# Altium schematic sheet Schematic1_PCBr7.SchDoc
size 599 x 900 mm; SheetNumber: 1; SheetTotal: 1
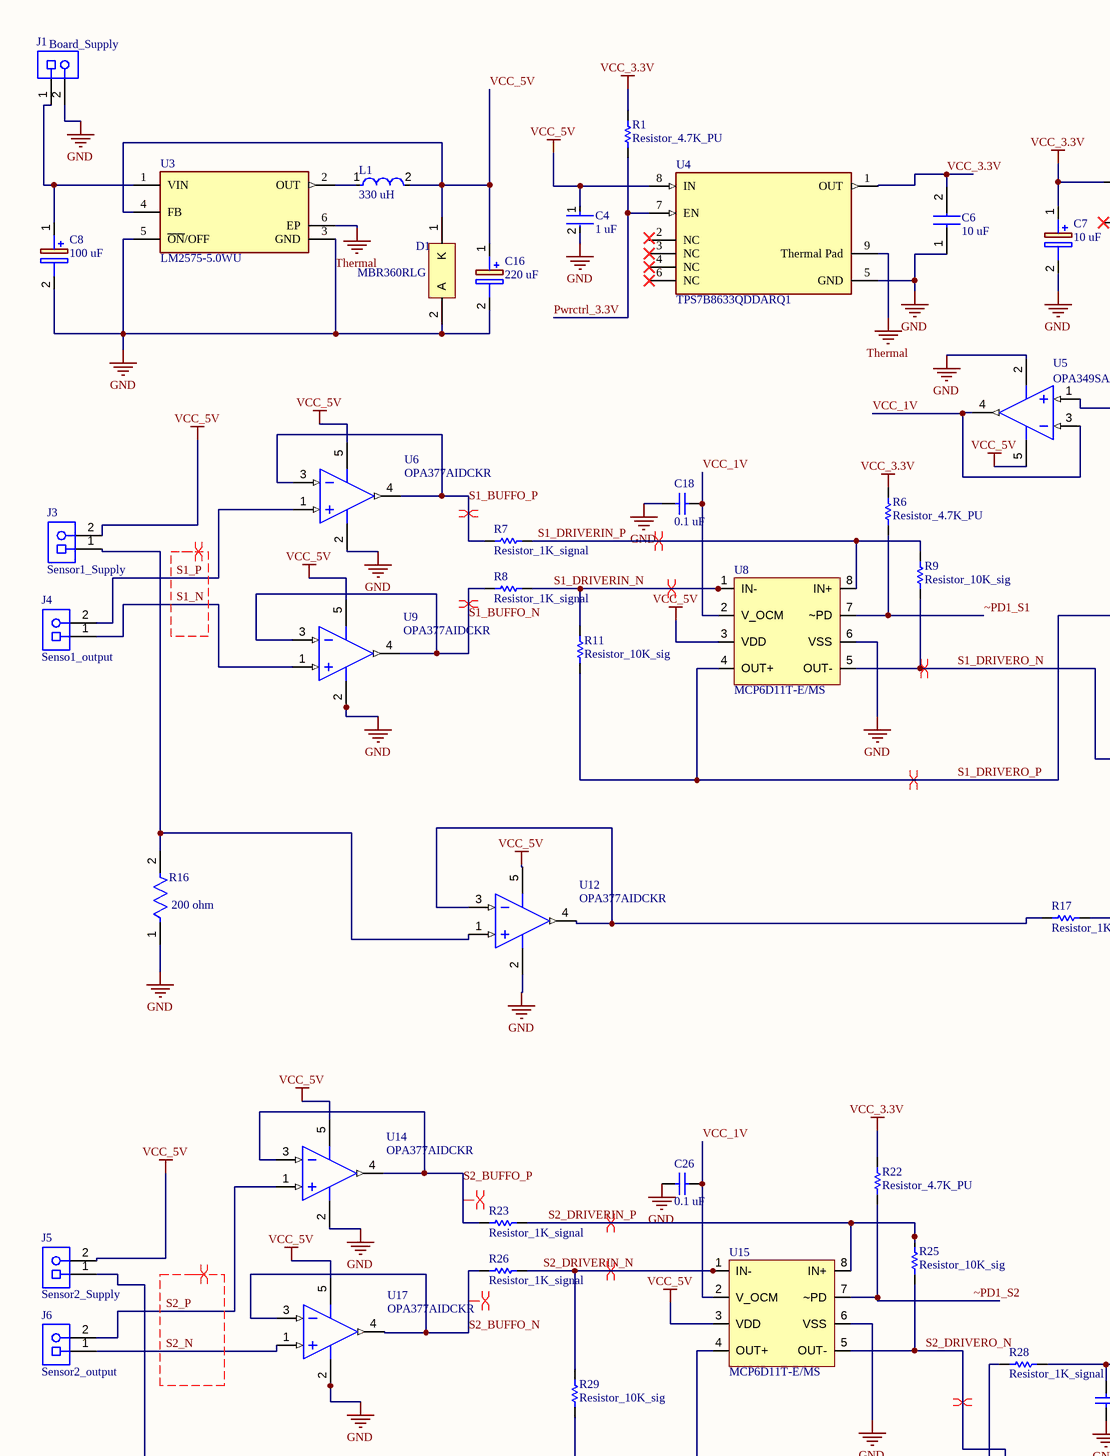
[diagram p0: Schematic1_PCBr7.SchDoc, top left]
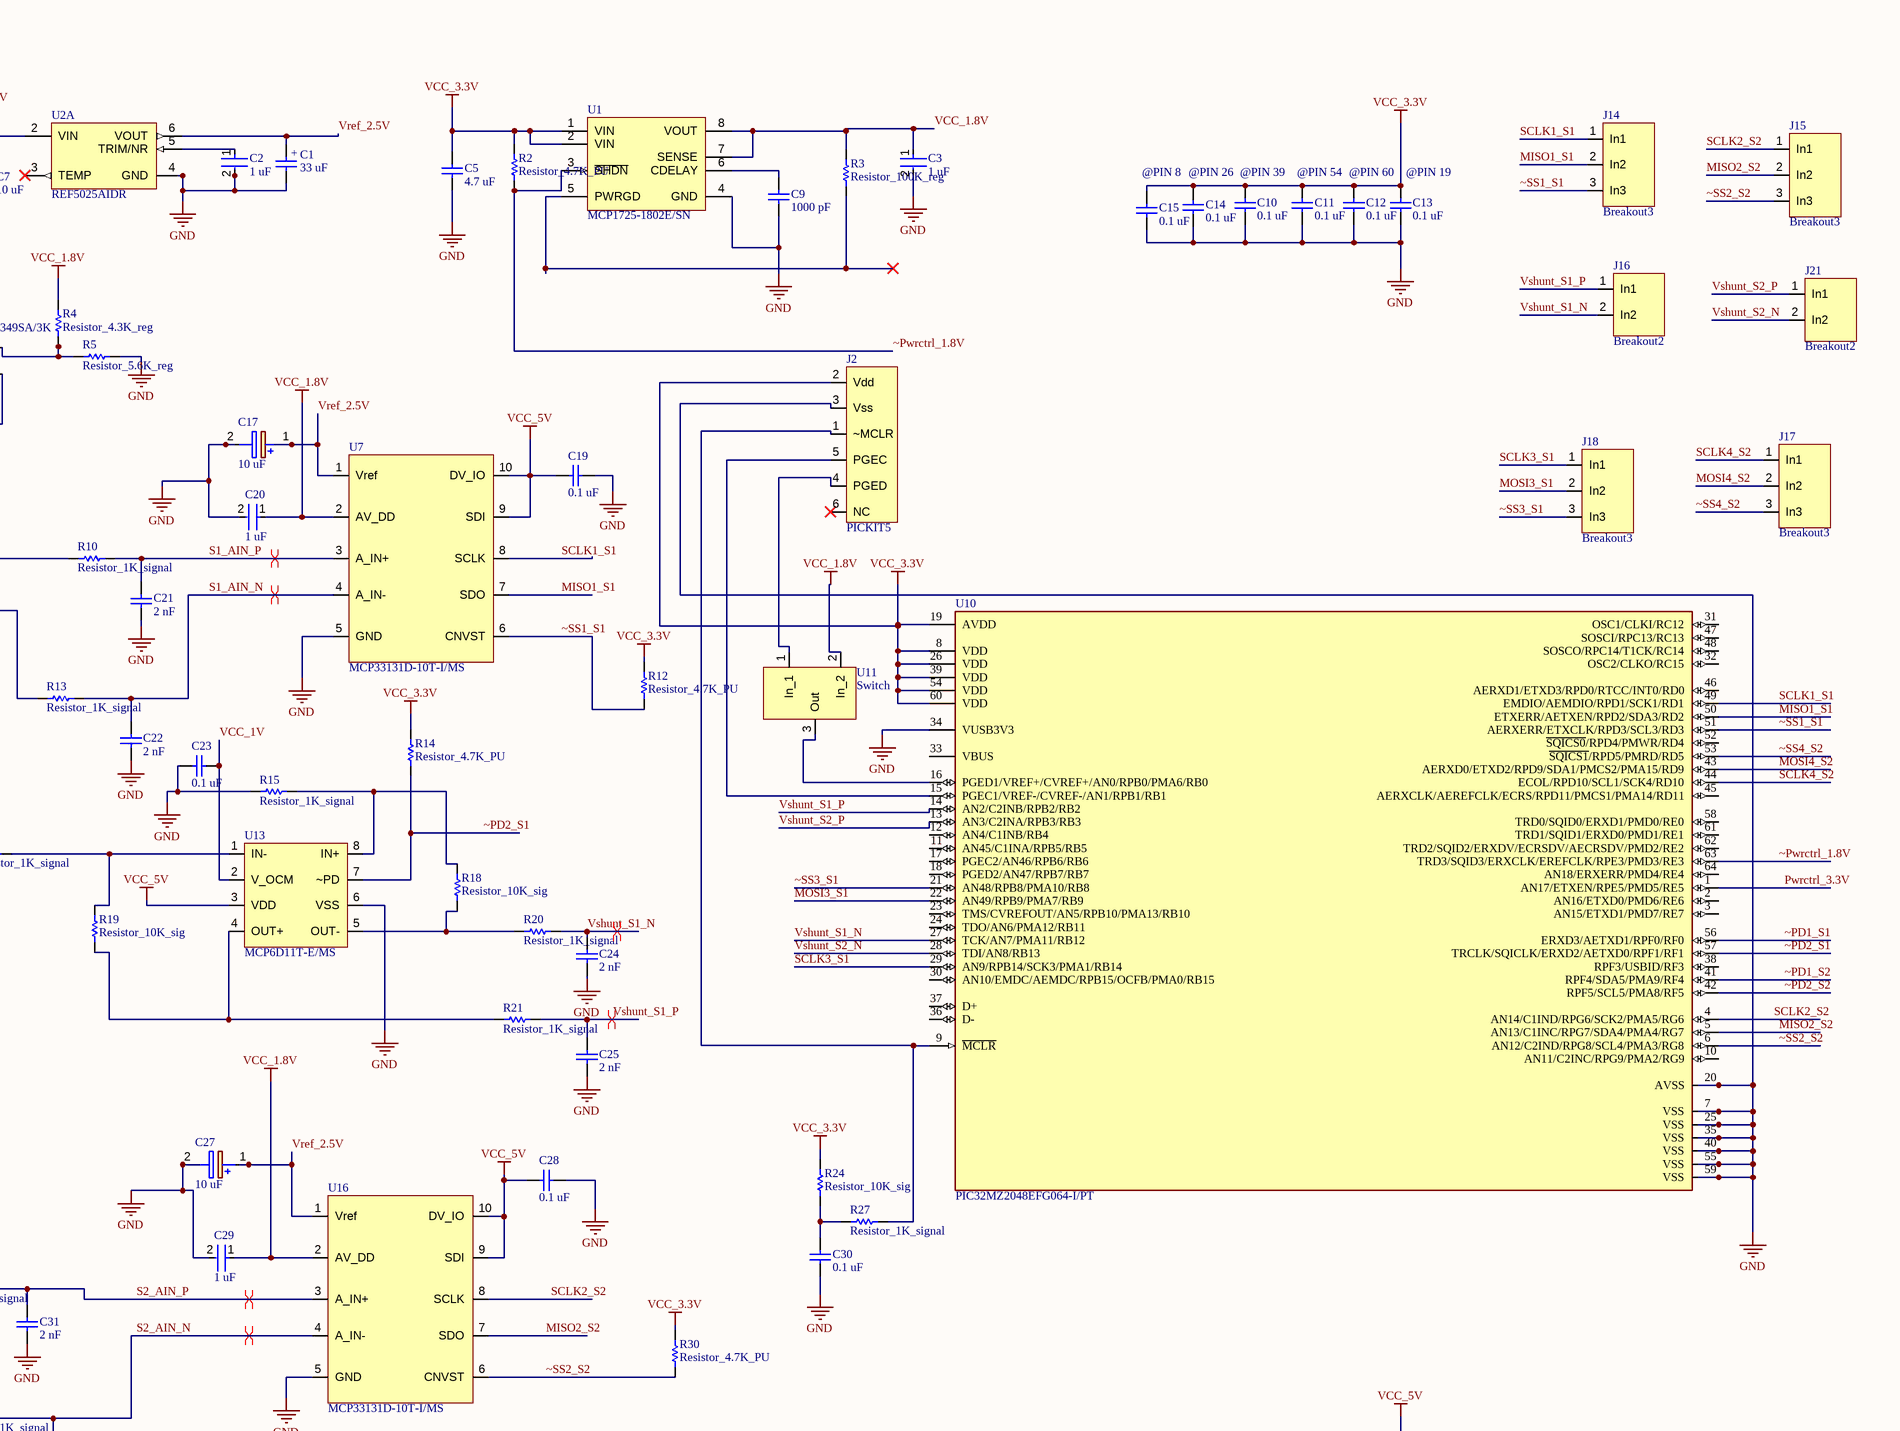
[diagram p1: Schematic1_PCBr7.SchDoc, top right]
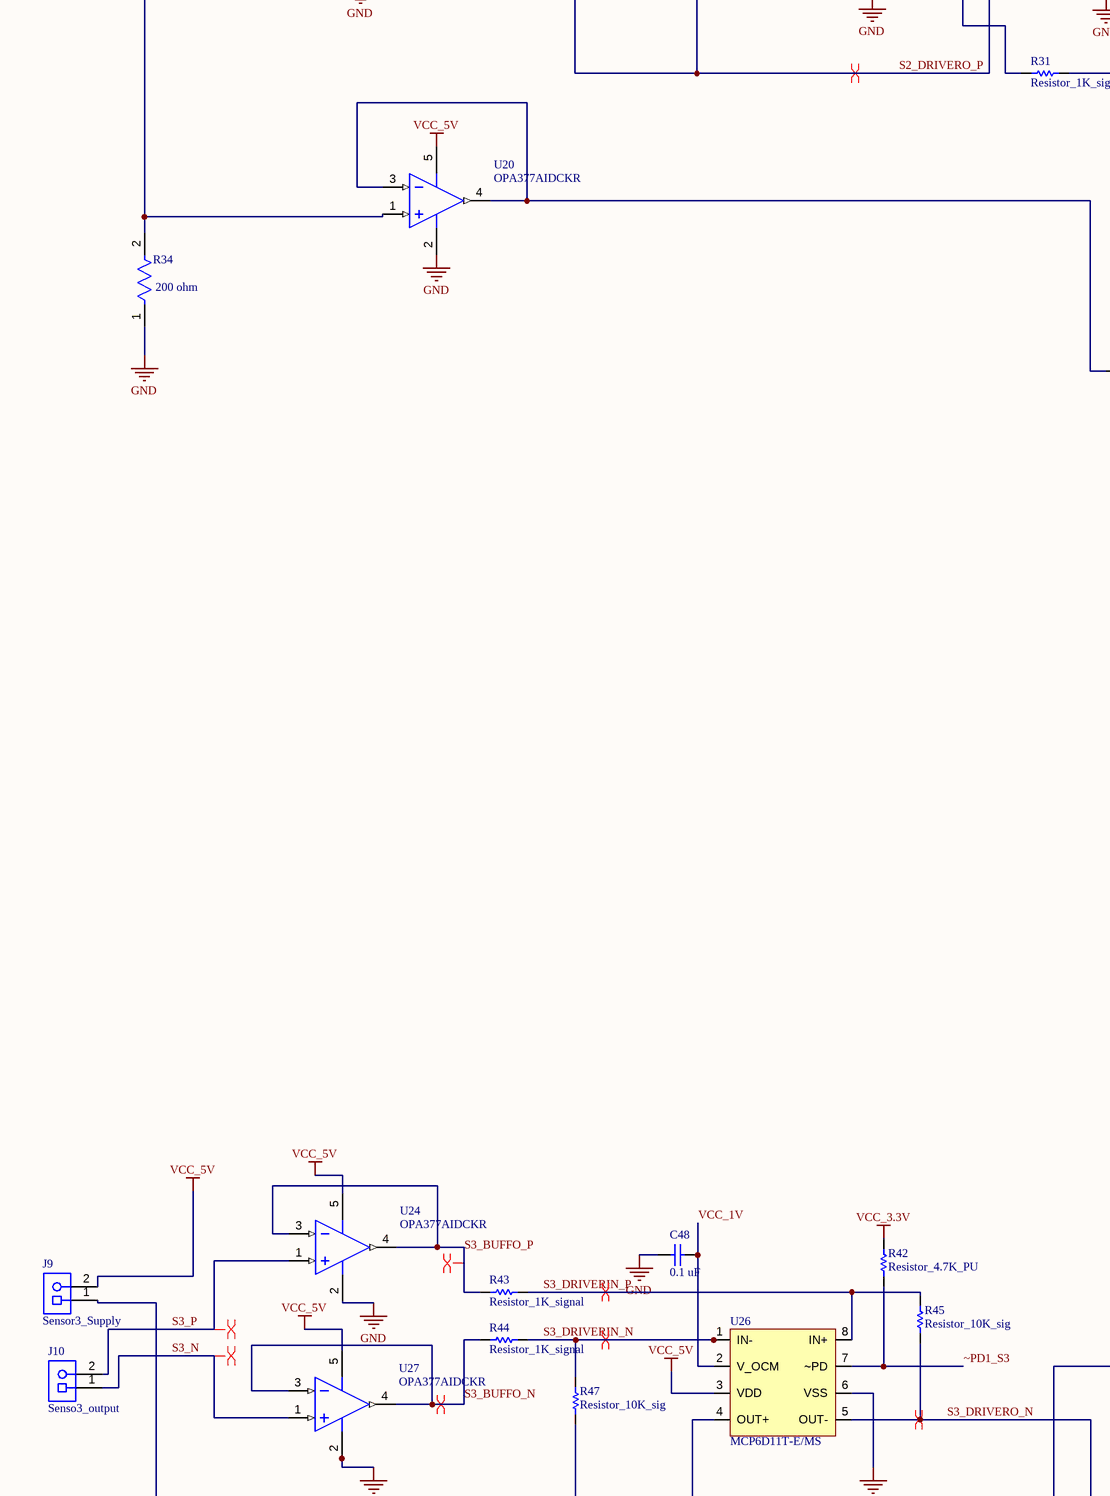
[diagram p2: Schematic1_PCBr7.SchDoc, centre left]
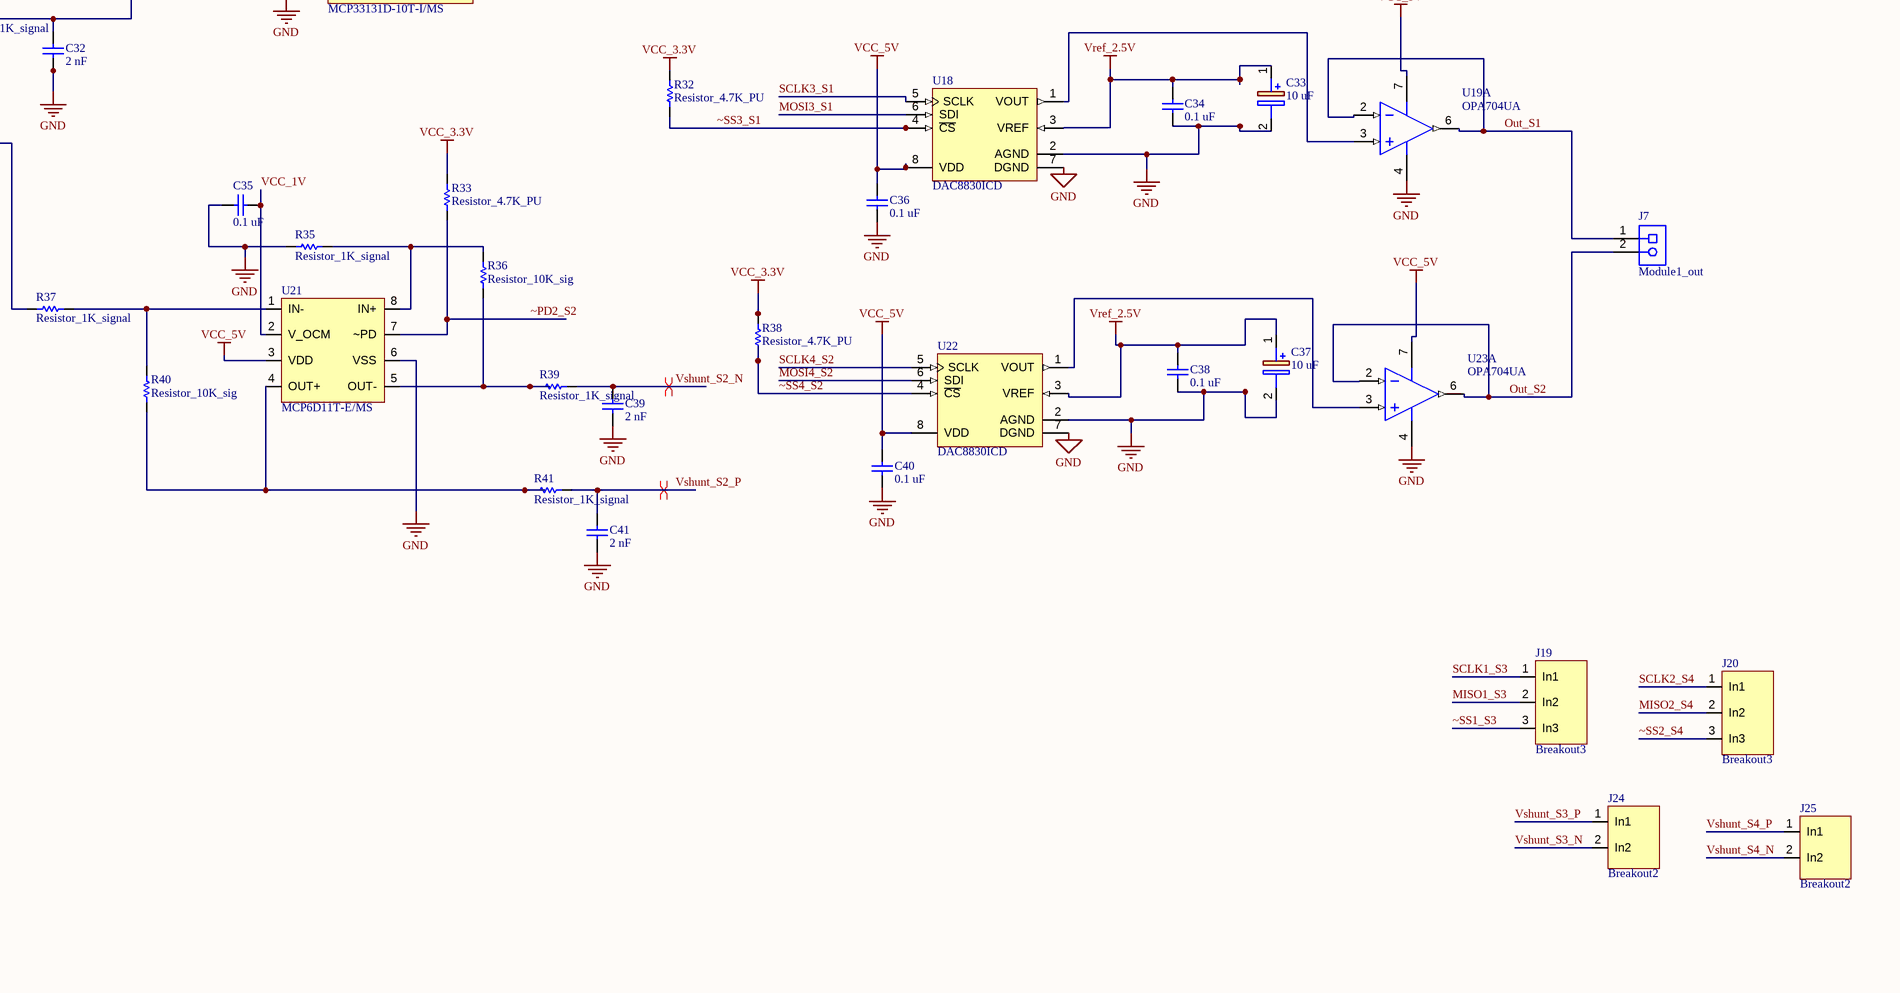
[diagram p3: Schematic1_PCBr7.SchDoc, centre right]
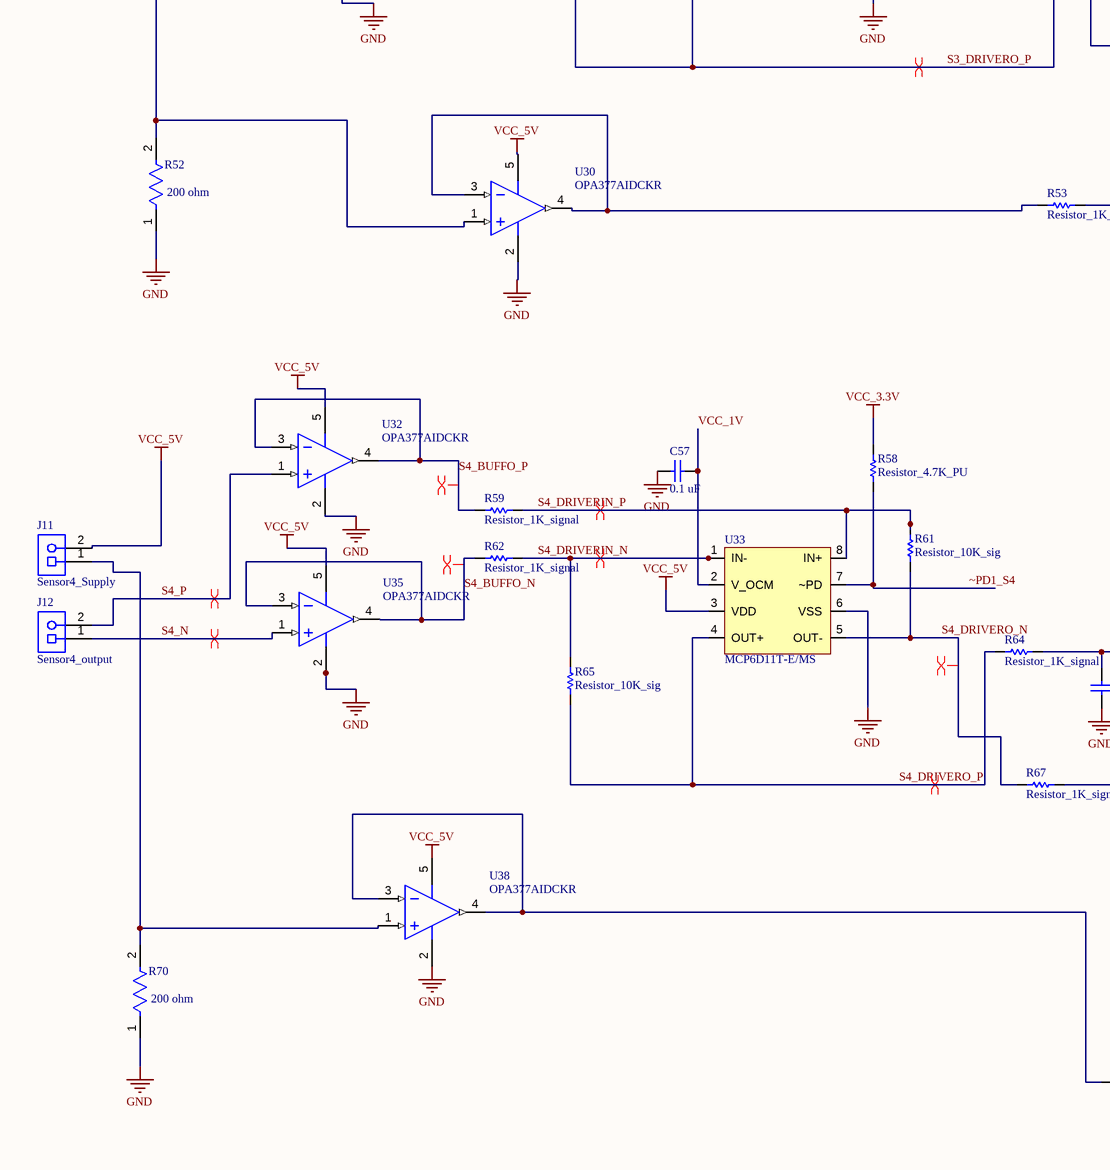
[diagram p4: Schematic1_PCBr7.SchDoc, bottom left]
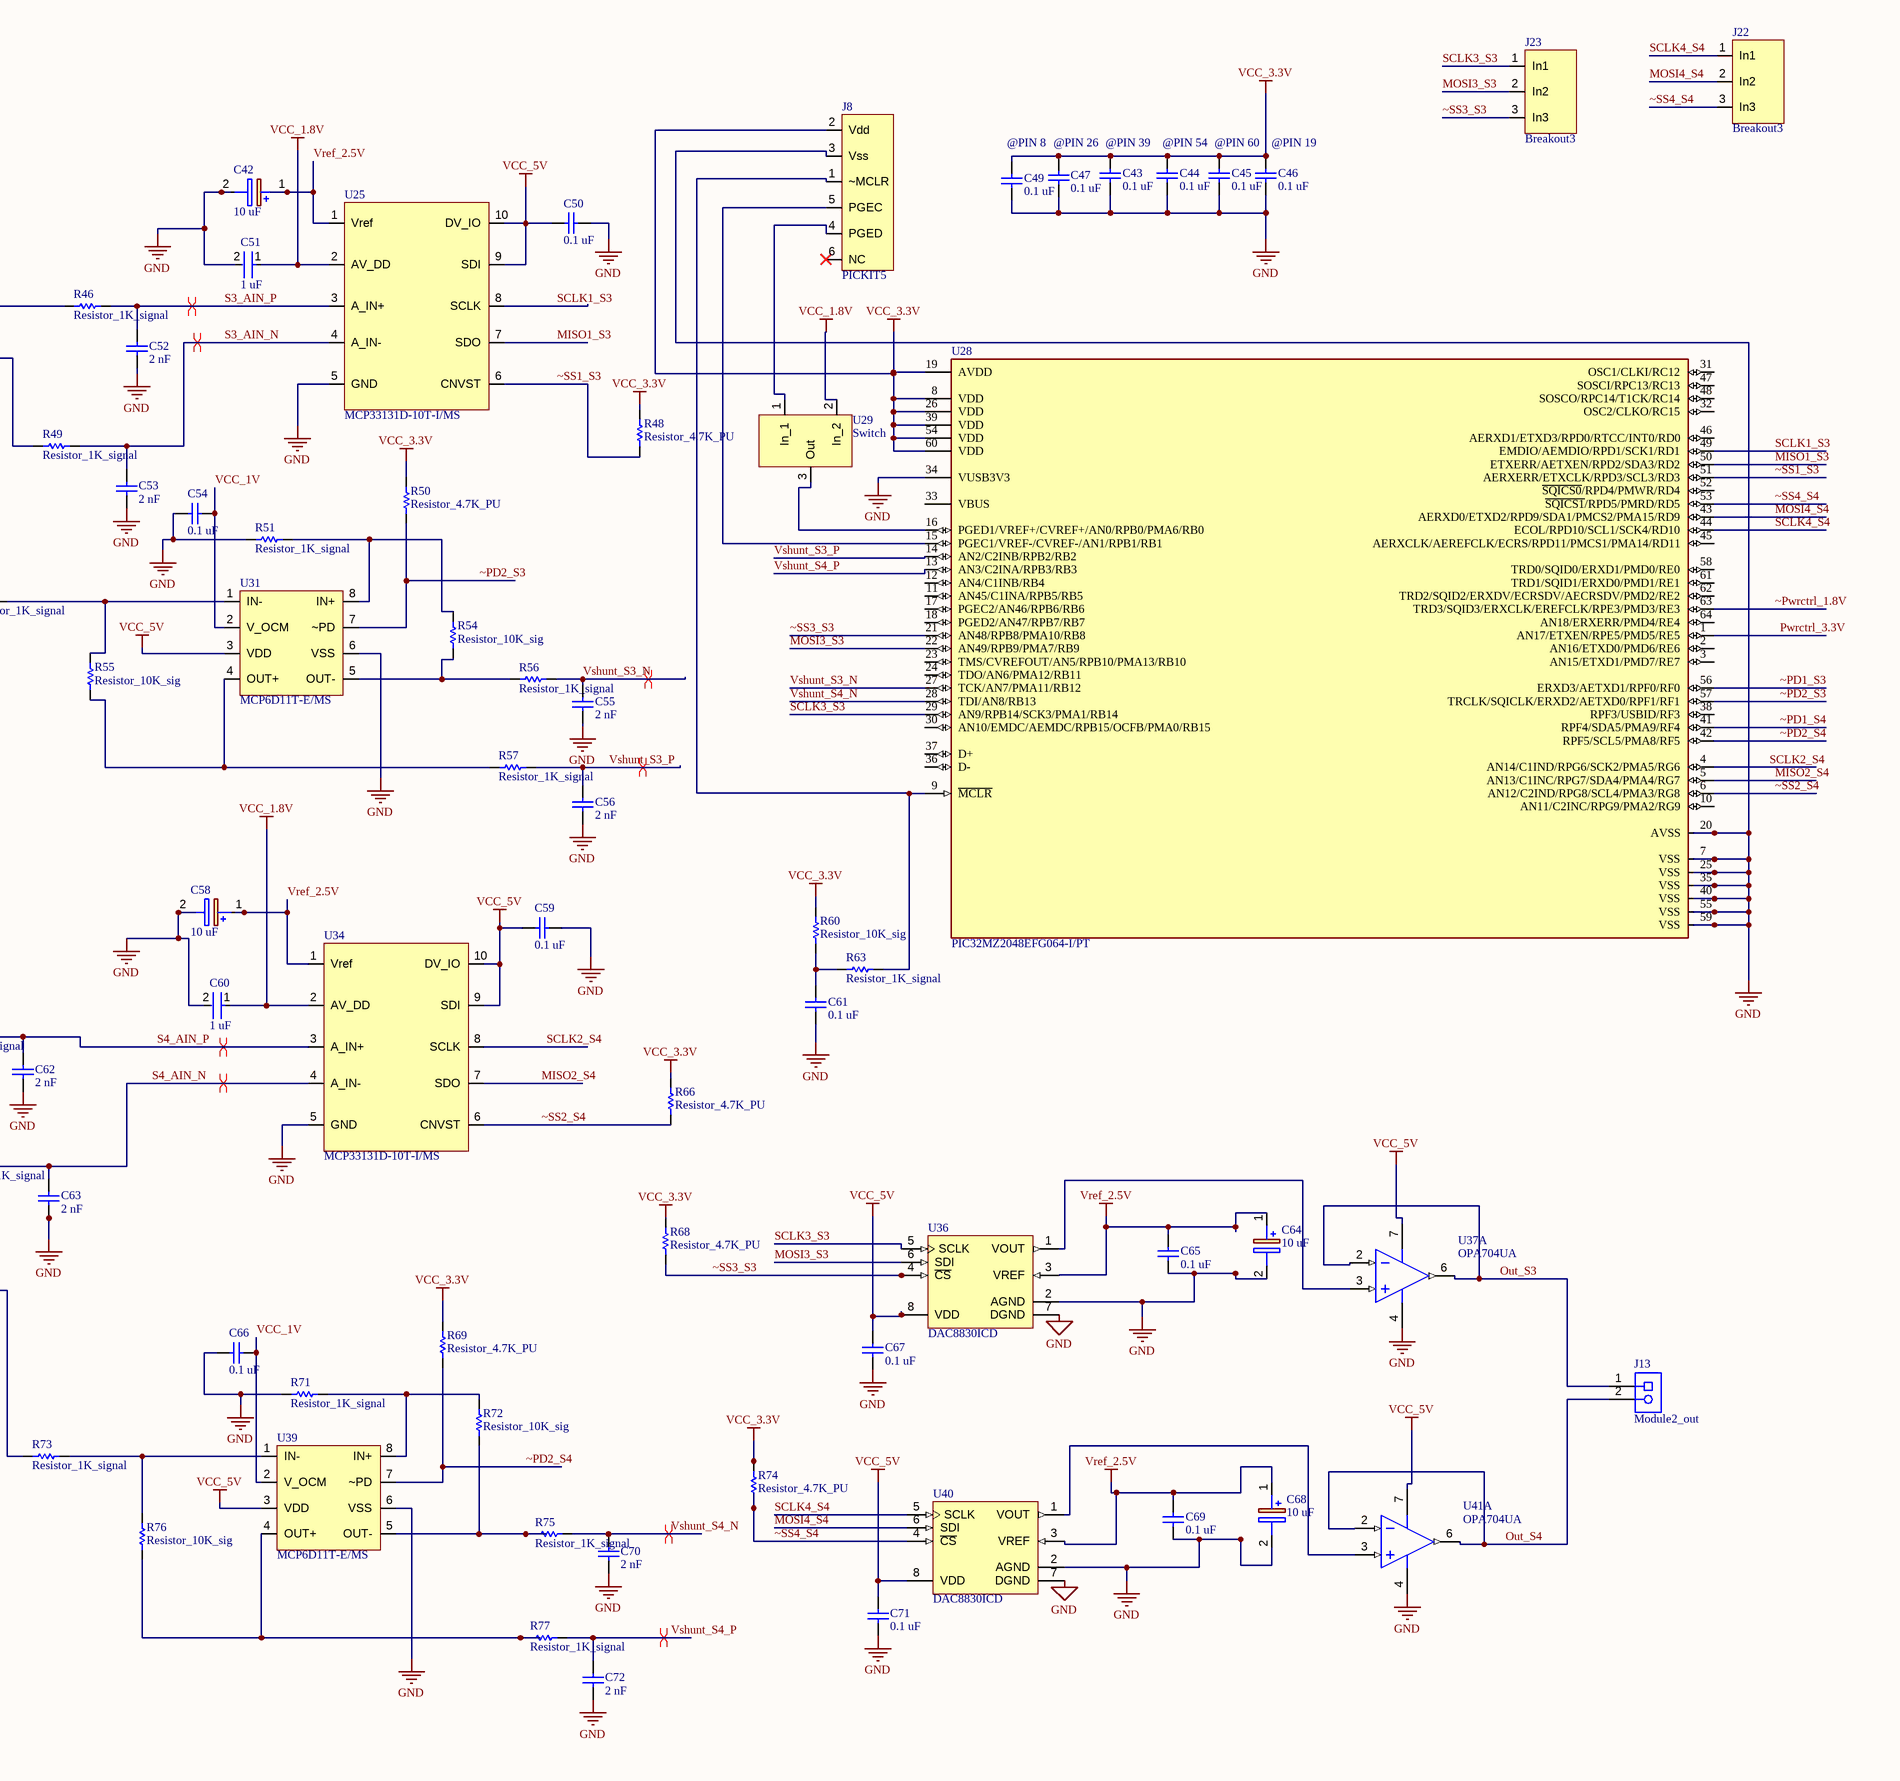
[diagram p5: Schematic1_PCBr7.SchDoc, bottom right]

## Parts
C1  33 uF  [Tant_33uF]
C2  1 uF  [FP-0805-L_2_01_0_2-W_1_25-MFG]
C3  1 uF  [FP-0805-L_2_01_0_2-W_1_25-MFG]
C4  1 uF  [FP-0805-L_2_01_0_2-W_1_25-MFG]
C5  4.7 uF  [C_1206]
C6  10 uF  [Ceramic_1206]
C7  10 uF  [CAPPM6032X280N]
C8  100 uF  [CAPAE830X1050N]
C9  1000 pF  [CAPC2013X140X50NL20T25]
C10  0.1 uF  [CAPC1608X90X35LL10T15]
C11  0.1 uF  [CAPC1608X90X35LL10T15]
C12  0.1 uF  [CAPC1608X90X35LL10T15]
C13  0.1 uF  [CAPC1608X90X35LL10T15]
C14  0.1 uF  [CAPC1608X90X35LL10T15]
C15  0.1 uF  [CAPC1608X90X35LL10T15]
C16  220 uF  [CAPAE830X1050N]
C17  10 uF  [CAPPM6032X280N]
C18  0.1 uF  [CAPC1608X90X35LL10T15]
C19  0.1 uF  [CAPC1608X90X35LL10T15]
C20  1 uF  [FP-0805-L_2_01_0_2-W_1_25-MFG]
C21  2 nF  [C_0805]
C22  2 nF  [C_0805]
C23  0.1 uF  [CAPC1608X90X35LL10T15]
C24  2 nF  [C_0805]
C25  2 nF  [C_0805]
C26  0.1 uF  [CAPC1608X90X35LL10T15]
C27  10 uF  [CAPPM6032X280N]
C28  0.1 uF  [CAPC1608X90X35LL10T15]
C29  1 uF  [FP-0805-L_2_01_0_2-W_1_25-MFG]
C30  0.1 uF  [CAPC1608X90X35LL10T15]
C31  2 nF  [C_0805]
C32  2 nF  [C_0805]
C33  10 uF  [CAPPM6032X280N]
C34  0.1 uF  [CAPC1608X90X35LL10T15]
C35  0.1 uF  [CAPC1608X90X35LL10T15]
C36  0.1 uF  [CAPC1608X90X35LL10T15]
C37  10 uF  [CAPPM6032X280N]
C38  0.1 uF  [CAPC1608X90X35LL10T15]
C39  2 nF  [C_0805]
C40  0.1 uF  [CAPC1608X90X35LL10T15]
C41  2 nF  [C_0805]
C42  10 uF  [CAPPM6032X280N]
C43  0.1 uF  [CAPC1608X90X35LL10T15]
C44  0.1 uF  [CAPC1608X90X35LL10T15]
C45  0.1 uF  [CAPC1608X90X35LL10T15]
C46  0.1 uF  [CAPC1608X90X35LL10T15]
C47  0.1 uF  [CAPC1608X90X35LL10T15]
C48  0.1 uF  [CAPC1608X90X35LL10T15]
C49  0.1 uF  [CAPC1608X90X35LL10T15]
C50  0.1 uF  [CAPC1608X90X35LL10T15]
C51  1 uF  [FP-0805-L_2_01_0_2-W_1_25-MFG]
C52  2 nF  [C_0805]
C53  2 nF  [C_0805]
C54  0.1 uF  [CAPC1608X90X35LL10T15]
C55  2 nF  [C_0805]
C56  2 nF  [C_0805]
C57  0.1 uF  [CAPC1608X90X35LL10T15]
C58  10 uF  [CAPPM6032X280N]
C59  0.1 uF  [CAPC1608X90X35LL10T15]
C60  1 uF  [FP-0805-L_2_01_0_2-W_1_25-MFG]
C61  0.1 uF  [CAPC1608X90X35LL10T15]
C62  2 nF  [C_0805]
C63  2 nF  [C_0805]
C64  10 uF  [CAPPM6032X280N]
C65  0.1 uF  [CAPC1608X90X35LL10T15]
C66  0.1 uF  [CAPC1608X90X35LL10T15]
C67  0.1 uF  [CAPC1608X90X35LL10T15]
C68  10 uF  [CAPPM6032X280N]
C69  0.1 uF  [CAPC1608X90X35LL10T15]
C70  2 nF  [C_0805]
C71  0.1 uF  [CAPC1608X90X35LL10T15]
C72  2 nF  [C_0805]
D1  MBR360RLG  [ONSC-AXIAL_LEAD-2-267-05_V]
J1  Board_Supply  [PHOE-1729128-2_V]
J2  PICKIT5  [Breakout_con]
J3  Sensor1_Supply  [PHOE-1729128-2_V]
J4  Senso1_output  [PHOE-1729128-2_V]
J5  Sensor2_Supply  [PHOE-1729128-2_V]
J6  Sensor2_output  [PHOE-1729128-2_V]
J7  Module1_out  [PHOE-1729128-2_V]
J8  PICKIT5  [Breakout_con]
J9  Sensor3_Supply  [PHOE-1729128-2_V]
J10  Senso3_output  [PHOE-1729128-2_V]
J11  Sensor4_Supply  [PHOE-1729128-2_V]
J12  Sensor4_output  [PHOE-1729128-2_V]
J13  Module2_out  [PHOE-1729128-2_V]
J14  Breakout3  [Breakout_con3pin]
J15  Breakout3  [Breakout_con3pin]
J16  Breakout2  [Breakout_con2pin]
J17  Breakout3  [Breakout_con3pin]
J18  Breakout3  [Breakout_con3pin]
J19  Breakout3  [Breakout_con3pin]
J20  Breakout3  [Breakout_con3pin]
J21  Breakout2  [Breakout_con2pin]
J22  Breakout3  [Breakout_con3pin]
J23  Breakout3  [Breakout_con3pin]
J24  Breakout2  [Breakout_con2pin]
J25  Breakout2  [Breakout_con2pin]
L1  330 uH  [FP-CB2518-IPC_A]
R1  Resistor_4.7K_PU  [Res_0603]
R2  Resistor_4.7K_PU  [Res_0603]
R3  Resistor_100K_reg  [R_0603]
R4  Resistor_4.3K_reg  [Res_0603]
R5  Resistor_5.6K_reg  [Res_0603]
R6  Resistor_4.7K_PU  [Res_0603]
R7  Resistor_1K_signal  [R_0603]
R8  Resistor_1K_signal  [R_0603]
R9  Resistor_10K_sig  [Res_0603]
R10  Resistor_1K_signal  [R_0603]
R11  Resistor_10K_sig  [Res_0603]
R12  Resistor_4.7K_PU  [Res_0603]
R13  Resistor_1K_signal  [R_0603]
R14  Resistor_4.7K_PU  [Res_0603]
R15  Resistor_1K_signal  [R_0603]
R16  200 ohm  [FP-CRCW0603-e3-MFG]
R17  Resistor_1K_signal  [R_0603]
R18  Resistor_10K_sig  [Res_0603]
R19  Resistor_10K_sig  [Res_0603]
R20  Resistor_1K_signal  [R_0603]
R21  Resistor_1K_signal  [R_0603]
R22  Resistor_4.7K_PU  [Res_0603]
R23  Resistor_1K_signal  [R_0603]
R24  Resistor_10K_sig  [Res_0603]
R25  Resistor_10K_sig  [Res_0603]
R26  Resistor_1K_signal  [R_0603]
R27  Resistor_1K_signal  [R_0603]
R28  Resistor_1K_signal  [R_0603]
R29  Resistor_10K_sig  [Res_0603]
R30  Resistor_4.7K_PU  [Res_0603]
R31  Resistor_1K_signal  [R_0603]
R32  Resistor_4.7K_PU  [Res_0603]
R33  Resistor_4.7K_PU  [Res_0603]
R34  200 ohm  [FP-CRCW0603-e3-MFG]
R35  Resistor_1K_signal  [R_0603]
R36  Resistor_10K_sig  [Res_0603]
R37  Resistor_1K_signal  [R_0603]
R38  Resistor_4.7K_PU  [Res_0603]
R39  Resistor_1K_signal  [R_0603]
R40  Resistor_10K_sig  [Res_0603]
R41  Resistor_1K_signal  [R_0603]
R42  Resistor_4.7K_PU  [Res_0603]
R43  Resistor_1K_signal  [R_0603]
R44  Resistor_1K_signal  [R_0603]
R45  Resistor_10K_sig  [Res_0603]
R46  Resistor_1K_signal  [R_0603]
R47  Resistor_10K_sig  [Res_0603]
R48  Resistor_4.7K_PU  [Res_0603]
R49  Resistor_1K_signal  [R_0603]
R50  Resistor_4.7K_PU  [Res_0603]
R51  Resistor_1K_signal  [R_0603]
R52  200 ohm  [FP-CRCW0603-e3-MFG]
R53  Resistor_1K_signal  [R_0603]
R54  Resistor_10K_sig  [Res_0603]
R55  Resistor_10K_sig  [Res_0603]
R56  Resistor_1K_signal  [R_0603]
R57  Resistor_1K_signal  [R_0603]
R58  Resistor_4.7K_PU  [Res_0603]
R59  Resistor_1K_signal  [R_0603]
R60  Resistor_10K_sig  [Res_0603]
R61  Resistor_10K_sig  [Res_0603]
R62  Resistor_1K_signal  [R_0603]
R63  Resistor_1K_signal  [R_0603]
R64  Resistor_1K_signal  [R_0603]
R65  Resistor_10K_sig  [Res_0603]
R66  Resistor_4.7K_PU  [Res_0603]
R67  Resistor_1K_signal  [R_0603]
R68  Resistor_4.7K_PU  [Res_0603]
R69  Resistor_4.7K_PU  [Res_0603]
R70  200 ohm  [FP-CRCW0603-e3-MFG]
R71  Resistor_1K_signal  [R_0603]
R72  Resistor_10K_sig  [Res_0603]
R73  Resistor_1K_signal  [R_0603]
R74  Resistor_4.7K_PU  [Res_0603]
R75  Resistor_1K_signal  [R_0603]
R76  Resistor_10K_sig  [Res_0603]
R77  Resistor_1K_signal  [R_0603]
U1  MCP1725-1802E/SN  [SOIC-SN8_M]
U2  REF5025AIDR  [D0008A_L]  (part A of 2)
U3  LM2575-5.0WU  [FP-TO263-5LD-PL-1-MFG]
U4  TPS7B8633QDDARQ1  [FP-DDA0008B-MFG]
U5  OPA349SA/3K  [DCK0005A_L]
U6  OPA377AIDCKR  [DCK0005A_M]
U7  MCP33131D-10T-I/MS  [MSOP10]
U8  MCP6D11T-E/MS  [MSOP8]
U9  OPA377AIDCKR  [DCK0005A_M]
U10  PIC32MZ2048EFG064-I/PT  [FP-C04-085-PT-IPC_C]
U11  Switch  [Switch]
U12  OPA377AIDCKR  [DCK0005A_M]
U13  MCP6D11T-E/MS  [MSOP8]
U14  OPA377AIDCKR  [DCK0005A_M]
U15  MCP6D11T-E/MS  [MSOP8]
U16  MCP33131D-10T-I/MS  [MSOP10]
U17  OPA377AIDCKR  [DCK0005A_M]
U18  DAC8830ICD  [TI-D8_N]
U19  OPA704UA  [D0008A_N]  (part A of 2)
U20  OPA377AIDCKR  [DCK0005A_M]
U21  MCP6D11T-E/MS  [MSOP8]
U22  DAC8830ICD  [TI-D8_N]
U23  OPA704UA  [D0008A_N]  (part A of 2)
U24  OPA377AIDCKR  [DCK0005A_M]
U25  MCP33131D-10T-I/MS  [MSOP10]
U26  MCP6D11T-E/MS  [MSOP8]
U27  OPA377AIDCKR  [DCK0005A_M]
U28  PIC32MZ2048EFG064-I/PT  [FP-C04-085-PT-IPC_C]
U29  Switch  [Switch]
U30  OPA377AIDCKR  [DCK0005A_M]
U31  MCP6D11T-E/MS  [MSOP8]
U32  OPA377AIDCKR  [DCK0005A_M]
U33  MCP6D11T-E/MS  [MSOP8]
U34  MCP33131D-10T-I/MS  [MSOP10]
U35  OPA377AIDCKR  [DCK0005A_M]
U36  DAC8830ICD  [TI-D8_N]
U37  OPA704UA  [D0008A_N]  (part A of 2)
U38  OPA377AIDCKR  [DCK0005A_M]
U39  MCP6D11T-E/MS  [MSOP8]
U40  DAC8830ICD  [TI-D8_N]
U41  OPA704UA  [D0008A_N]  (part A of 2)

## Nets
GND: C1.2 C2.2 C3.2 C4.2 C5.1 C6.1 C7.2(-) C8.2(-) C9.1 C10.1 C11.1 C12.1 C13.1 C14.1 C15.1 C16.2(-) C17.2(-) C18.2 C19.1 C20.2 C21.1 C22.1 C23.2 C24.1 C25.1 C26.2 C27.2(-) C28.1 C29.2 C30.1 C31.1 C32.1 C33.2(-) C34.2 C35.2 C36.2 C37.2(-) C38.2 C39.1 C40.2 C41.1 C42.2(-) C43.1 C44.1 C45.1 C46.1 C47.1 C48.2 C49.1 C50.1 C51.2 C52.1 C53.1 C54.2 C55.1 C56.1 C57.2 C58.2(-) C59.1 C60.2 C61.1 C62.1 C63.1 C64.2(-) C65.2 C66.2 C67.2 C68.2(-) C69.2 C70.1 C71.2 C72.1 D1.2(A) J1.2 J2.3(Vss) J8.3(Vss) R5.2 R15.1 R16.1 R34.1 R35.1 R51.1 R52.1 R70.1 R71.1 U1.4(GND) U2.4(GND) U3.3(GND) U3.5(~{ON}/OFF) U4.5(GND) U5.2(V-) U6.2(V-) U7.5(GND) U8.6(VSS) U9.2(V-) U10.7(VSS) U10.20(AVSS) U10.25(VSS) U10.34(VUSB3V3) U10.35(VSS) U10.40(VSS) U10.55(VSS) U10.59(VSS) U12.2(V-) U13.6(VSS) U14.2(V-) U15.6(VSS) U16.5(GND) U17.2(V-) U18.2(AGND) U18.7(DGND) U19.4(V-) U20.2(V-) U21.6(VSS) U22.2(AGND) U22.7(DGND) U23.4(V-) U24.2(V-) U25.5(GND) U26.6(VSS) U27.2(V-) U28.7(VSS) U28.20(AVSS) U28.25(VSS) U28.34(VUSB3V3) U28.35(VSS) U28.40(VSS) U28.55(VSS) U28.59(VSS) U30.2(V-) U31.6(VSS) U32.2(V-) U33.6(VSS) U34.5(GND) U35.2(V-) U36.2(AGND) U36.7(DGND) U37.4(V-) U38.2(V-) U39.6(VSS) U40.2(AGND) U40.7(DGND) U41.4(V-)
Thermal: U3.6(EP) U4.9(Thermal_Pad)
VCC_1.8V: C3.1 C20.1 C29.1 C51.1 C60.1 R3.2 R4.2 U1.7(SENSE) U1.8(VOUT) U7.2(AV_DD) U11.2(In_2) U16.2(AV_DD) U25.2(AV_DD) U29.2(In_2) U34.2(AV_DD)
VCC_3.3V: C5.2 C6.2 C7.1(+) C10.2 C11.2 C12.2 C13.2 C14.2 C15.2 C43.2 C44.2 C45.2 C46.2 C47.2 C49.2 J2.2(Vdd) J8.2(Vdd) R1.2 R2.2 R6.2 R12.2 R14.2 R22.2 R24.2 R30.2 R32.2 R33.2 R38.2 R42.2 R48.2 R50.2 R58.2 R60.2 R66.2 R68.2 R69.2 R74.2 U1.1(VIN) U1.2(VIN) U2.2(VIN) U4.1(OUT) U10.8(VDD) U10.19(AVDD) U10.26(VDD) U10.39(VDD) U10.54(VDD) U10.60(VDD) U28.8(VDD) U28.19(AVDD) U28.26(VDD) U28.39(VDD) U28.54(VDD) U28.60(VDD)
VCC_5V: C4.1 C16.1(+) C19.2 C28.2 C36.1 C40.1 C50.2 C59.2 C67.1 C71.1 D1.1(K) J3.2 J5.2 J9.2 J11.2 L1.2 U3.4(FB) U4.8(IN) U5.5(V+) U6.5(V+) U7.9(SDI) U7.10(DV_IO) U8.3(VDD) U9.5(V+) U12.5(V+) U13.3(VDD) U14.5(V+) U15.3(VDD) U16.9(SDI) U16.10(DV_IO) U17.5(V+) U18.8(VDD) U19.7(V+) U20.5(V+) U21.3(VDD) U22.8(VDD) U23.7(V+) U24.5(V+) U25.9(SDI) U25.10(DV_IO) U26.3(VDD) U27.5(V+) U30.5(V+) U31.3(VDD) U32.5(V+) U33.3(VDD) U34.9(SDI) U34.10(DV_IO) U35.5(V+) U36.8(VDD) U37.7(V+) U38.5(V+) U39.3(VDD) U40.8(VDD) U41.7(V+)
Vref_2.5V: C1.1 C17.1(+) C27.1(+) C33.1(+) C34.1 C37.1(+) C38.1 C42.1(+) C58.1(+) C64.1(+) C65.1 C68.1(+) C69.1 U2.6(VOUT) U7.1(Vref) U16.1(Vref) U18.3(VREF) U22.3(VREF) U25.1(Vref) U34.1(Vref) U36.3(VREF) U40.3(VREF)
MISO1_S1: J14.2(In2) U7.7(SDO) U10.50(ETXERR/AETXEN/RPD2/SDA3/RD2)
MISO1_S3: J19.2(In2) U25.7(SDO) U28.50(ETXERR/AETXEN/RPD2/SDA3/RD2)
MISO2_S2: J15.2(In2) U10.5(AN13/C1INC/RPG7/SDA4/PMA4/RG7) U16.7(SDO)
MISO2_S4: J20.2(In2) U28.5(AN13/C1INC/RPG7/SDA4/PMA4/RG7) U34.7(SDO)
MOSI3_S1: J18.2(In2) U10.22(AN49/RPB9/PMA7/RB9) U18.6(SDI)
MOSI3_S3: J23.2(In2) U28.22(AN49/RPB9/PMA7/RB9) U36.6(SDI)
MOSI4_S2: J17.2(In2) U10.43(AERXD0/ETXD2/RPD9/SDA1/PMCS2/PMA15/RD9) U22.6(SDI)
MOSI4_S4: J22.2(In2) U28.43(AERXD0/ETXD2/RPD9/SDA1/PMCS2/PMA15/RD9) U40.6(SDI)
Out_S1: J7.1 U19.2(IN-) U19.6(OUT)
Out_S2: J7.2 U23.2(IN-) U23.6(OUT)
Out_S3: J13.1 U37.2(IN-) U37.6(OUT)
Out_S4: J13.2 U41.2(IN-) U41.6(OUT)
Pwrctrl_3.3V: R1.1 U4.7(EN) U10.1(AN17/ETXEN/RPE5/PMD5/RE5) U28.1(AN17/ETXEN/RPE5/PMD5/RE5)
S1_AIN_N: C22.2 R13.2 U7.4(A_IN-)
S1_AIN_P: C21.2 R10.2 U7.3(A_IN+)
S1_BUFFO_N: R8.1 U9.3(IN-) U9.4(OUT)
S1_BUFFO_P: R7.1 U6.3(IN-) U6.4(OUT)
S1_DRIVERIN_N: R8.2 R11.2 U8.1(IN-)
S1_DRIVERIN_P: R7.2 R9.2 U8.8(IN+)
S1_DRIVERO_N: R9.1 R13.1 U8.5(OUT-)
S1_DRIVERO_P: R10.1 R11.1 U8.4(OUT+)
S1_N: J4.1 U9.1(IN+)
S1_P: J4.2 U6.1(IN+)
S2_AIN_N: C32.2 R31.2 U16.4(A_IN-)
S2_AIN_P: C31.2 R28.2 U16.3(A_IN+)
S2_BUFFO_N: R26.1 U17.3(IN-) U17.4(OUT)
S2_BUFFO_P: R23.1 U14.3(IN-) U14.4(OUT)
S2_DRIVERIN_N: R26.2 R29.2 U15.1(IN-)
S2_DRIVERIN_P: R23.2 R25.2 U15.8(IN+)
S2_DRIVERO_N: R25.1 R31.1 U15.5(OUT-)
S2_DRIVERO_P: R28.1 R29.1 U15.4(OUT+)
S2_N: J6.1 U17.1(IN+)
S2_P: J6.2 U14.1(IN+)
S3_AIN_N: C53.2 R49.2 U25.4(A_IN-)
S3_AIN_P: C52.2 R46.2 U25.3(A_IN+)
S3_BUFFO_N: R44.1 U27.3(IN-) U27.4(OUT)
S3_BUFFO_P: R43.1 U24.3(IN-) U24.4(OUT)
S3_DRIVERIN_N: R44.2 R47.2 U26.1(IN-)
S3_DRIVERIN_P: R43.2 R45.2 U26.8(IN+)
S3_DRIVERO_N: R45.1 R49.1 U26.5(OUT-)
S3_DRIVERO_P: R46.1 R47.1 U26.4(OUT+)
S3_N: J10.1 U27.1(IN+)
S3_P: J10.2 U24.1(IN+)
S4_AIN_N: C63.2 R67.2 U34.4(A_IN-)
S4_AIN_P: C62.2 R64.2 U34.3(A_IN+)
S4_BUFFO_N: R62.1 U35.3(IN-) U35.4(OUT)
S4_BUFFO_P: R59.1 U32.3(IN-) U32.4(OUT)
S4_DRIVERIN_N: R62.2 R65.2 U33.1(IN-)
S4_DRIVERIN_P: R59.2 R61.2 U33.8(IN+)
S4_DRIVERO_N: R61.1 R67.1 U33.5(OUT-)
S4_DRIVERO_P: R64.1 R65.1 U33.4(OUT+)
S4_N: J12.1 U35.1(IN+)
S4_P: J12.2 U32.1(IN+)
SCLK1_S1: J14.1(In1) U7.8(SCLK) U10.49(EMDIO/AEMDIO/RPD1/SCK1/RD1)
SCLK1_S3: J19.1(In1) U25.8(SCLK) U28.49(EMDIO/AEMDIO/RPD1/SCK1/RD1)
SCLK2_S2: J15.1(In1) U10.4(AN14/C1IND/RPG6/SCK2/PMA5/RG6) U16.8(SCLK)
SCLK2_S4: J20.1(In1) U28.4(AN14/C1IND/RPG6/SCK2/PMA5/RG6) U34.8(SCLK)
SCLK3_S1: J18.1(In1) U10.29(AN9/RPB14/SCK3/PMA1/RB14) U18.5(SCLK)
SCLK3_S3: J23.1(In1) U28.29(AN9/RPB14/SCK3/PMA1/RB14) U36.5(SCLK)
SCLK4_S2: J17.1(In1) U10.44(ECOL/RPD10/SCL1/SCK4/RD10) U22.5(SCLK)
SCLK4_S4: J22.1(In1) U28.44(ECOL/RPD10/SCL1/SCK4/RD10) U40.5(SCLK)
VCC_1V: C18.1 C23.1 C26.1 C35.1 C48.1 C54.1 C57.1 C66.1 U5.3(IN-) U5.4(OUT) U8.2(V_OCM) U13.2(V_OCM) U15.2(V_OCM) U21.2(V_OCM) U26.2(V_OCM) U31.2(V_OCM) U33.2(V_OCM) U39.2(V_OCM)
Vshunt_S1_N: C24.2 J16.2(In2) R20.2 U10.27(TCK/AN7/PMA11/RB12)
Vshunt_S1_P: C25.2 J16.1(In1) R21.2 U10.14(AN2/C2INB/RPB2/RB2)
Vshunt_S2_N: C39.2 J21.2(In2) R39.2 U10.28(TDI/AN8/RB13)
Vshunt_S2_P: C41.2 J21.1(In1) R41.2 U10.13(AN3/C2INA/RPB3/RB3)
Vshunt_S3_N: C55.2 J24.2(In2) R56.2 U28.27(TCK/AN7/PMA11/RB12)
Vshunt_S3_P: C56.2 J24.1(In1) R57.2 U28.14(AN2/C2INB/RPB2/RB2)
Vshunt_S4_N: C70.2 J25.2(In2) R75.2 U28.28(TDI/AN8/RB13)
Vshunt_S4_P: C72.2 J25.1(In1) R77.2 U28.13(AN3/C2INA/RPB3/RB3)
~PD1_S1: R6.1 U8.7(~PD) U10.56(ERXD3/AETXD1/RPF0/RF0)
~PD1_S2: R22.1 U10.41(RPF4/SDA5/PMA9/RF4) U15.7(~PD)
~PD1_S3: R42.1 U26.7(~PD) U28.56(ERXD3/AETXD1/RPF0/RF0)
~PD1_S4: R58.1 U28.41(RPF4/SDA5/PMA9/RF4) U33.7(~PD)
~PD2_S1: R14.1 U10.57(TRCLK/SQICLK/ERXD2/AETXD0/RPF1/RF1) U13.7(~PD)
~PD2_S2: R33.1 U10.42(RPF5/SCL5/PMA8/RF5) U21.7(~PD)
~PD2_S3: R50.1 U28.57(TRCLK/SQICLK/ERXD2/AETXD0/RPF1/RF1) U31.7(~PD)
~PD2_S4: R69.1 U28.42(RPF5/SCL5/PMA8/RF5) U39.7(~PD)
~Pwrctrl_1.8V: R2.1 U1.3(~{SHDN}) U10.63(TRD3/SQID3/ERXCLK/EREFCLK/RPE3/PMD3/RE3) U28.63(TRD3/SQID3/ERXCLK/EREFCLK/RPE3/PMD3/RE3)
~SS1_S1: J14.3(In3) R12.1 U7.6(CNVST) U10.51(AERXERR/ETXCLK/RPD3/SCL3/RD3)
~SS1_S3: J19.3(In3) R48.1 U25.6(CNVST) U28.51(AERXERR/ETXCLK/RPD3/SCL3/RD3)
~SS2_S2: J15.3(In3) R30.1 U10.6(AN12/C2IND/RPG8/SCL4/PMA3/RG8) U16.6(CNVST)
~SS2_S4: J20.3(In3) R66.1 U28.6(AN12/C2IND/RPG8/SCL4/PMA3/RG8) U34.6(CNVST)
~SS3_S1: J18.3(In3) R32.1 U10.21(AN48/RPB8/PMA10/RB8) U18.4(~{CS})
~SS3_S3: J23.3(In3) R68.1 U28.21(AN48/RPB8/PMA10/RB8) U36.4(~{CS})
~SS4_S2: J17.3(In3) R38.1 U10.53(~{SQICS1}/RPD5/PMRD/RD5) U22.4(~{CS})
~SS4_S4: J22.3(In3) R74.1 U28.53(~{SQICS1}/RPD5/PMRD/RD5) U40.4(~{CS})
NetC2_1: C2.1 U2.5(TRIM/NR)
NetC8_1: C8.1(+) J1.1 U3.1(VIN)
NetC9_2: C9.2 U1.6(CDELAY)
NetC30_2: C30.2 R24.1 R27.1
NetC61_2: C61.2 R60.1 R63.1
NetJ2_1: J2.1(~MCLR) R27.2 U10.9(~{MCLR})
NetJ2_4: J2.4(PGED) U11.1(In_1)
NetJ2_5: J2.5(PGEC) U10.15(PGEC1/VREF-/CVREF-/AN1/RPB1/RB1)
NetJ3_1: J3.1 R16.2 U12.1(IN+)
NetJ5_1: J5.1 R34.2 U20.1(IN+)
NetJ8_1: J8.1(~MCLR) R63.2 U28.9(~{MCLR})
NetJ8_4: J8.4(PGED) U29.1(In_1)
NetJ8_5: J8.5(PGEC) U28.15(PGEC1/VREF-/CVREF-/AN1/RPB1/RB1)
NetJ9_1: J9.1 R52.2 U30.1(IN+)
NetJ11_1: J11.1 R70.2 U38.1(IN+)
NetL1_1: L1.1 U3.2(OUT)
NetR3_1: R3.1 U1.5(PWRGD)
NetR4_1: R4.1 R5.1 U5.1(IN+)
NetR15_2: R15.2 R18.2 U13.8(IN+)
NetR17_1: R17.1 U12.3(IN-) U12.4(OUT)
NetR17_2: R17.2 R19.2 U13.1(IN-)
NetR18_1: R18.1 R20.1 U13.5(OUT-)
NetR19_1: R19.1 R21.1 U13.4(OUT+)
NetR35_2: R35.2 R36.2 U21.8(IN+)
NetR36_1: R36.1 R39.1 U21.5(OUT-)
NetR37_1: R37.1 U20.3(IN-) U20.4(OUT)
NetR37_2: R37.2 R40.2 U21.1(IN-)
NetR40_1: R40.1 R41.1 U21.4(OUT+)
NetR51_2: R51.2 R54.2 U31.8(IN+)
NetR53_1: R53.1 U30.3(IN-) U30.4(OUT)
NetR53_2: R53.2 R55.2 U31.1(IN-)
NetR54_1: R54.1 R56.1 U31.5(OUT-)
NetR55_1: R55.1 R57.1 U31.4(OUT+)
NetR71_2: R71.2 R72.2 U39.8(IN+)
NetR72_1: R72.1 R75.1 U39.5(OUT-)
NetR73_1: R73.1 U38.3(IN-) U38.4(OUT)
NetR73_2: R73.2 R76.2 U39.1(IN-)
NetR76_1: R76.1 R77.1 U39.4(OUT+)
NetU10_16: U10.16(PGED1/VREF+/CVREF+/AN0/RPB0/PMA6/RB0) U11.3(Out)
NetU18_1: U18.1(VOUT) U19.3(IN+)
NetU22_1: U22.1(VOUT) U23.3(IN+)
NetU28_16: U28.16(PGED1/VREF+/CVREF+/AN0/RPB0/PMA6/RB0) U29.3(Out)
NetU36_1: U36.1(VOUT) U37.3(IN+)
NetU40_1: U40.1(VOUT) U41.3(IN+)

Not connected (* = marked no-connect by the designer): J2 6(NC)*; J8 6(NC)*; U2 3(TEMP)*; U4 2(NC) 3(NC)* 4(NC)* 6(NC)*; U10 2(AN16/ETXD0/PMD6/RE6) 3(AN15/ETXD1/PMD7/RE7) 10(AN11/C2INC/RPG9/PMA2/RG9) 11(AN45/C1INA/RPB5/RB5) 12(AN4/C1INB/RB4) 17(PGEC2/AN46/RPB6/RB6) 18(PGED2/AN47/RPB7/RB7) 23(TMS/CVREFOUT/AN5/RPB10/PMA13/RB10) 24(TDO/AN6/PMA12/RB11) 30(AN10/EMDC/AEMDC/RPB15/OCFB/PMA0/RB15) 31(OSC1/CLKI/RC12) 32(OSC2/CLKO/RC15) 33(VBUS) 36(D-) 37(D+) 38(RPF3/USBID/RF3) 45(AERXCLK/AEREFCLK/ECRS/RPD11/PMCS1/PMA14/RD11) 46(AERXD1/ETXD3/RPD0/RTCC/INT0/RD0) 47(SOSCI/RPC13/RC13) 48(SOSCO/RPC14/T1CK/RC14) 52(~{SQICS0}/RPD4/PMWR/RD4) 58(TRD0/SQID0/ERXD1/PMD0/RE0) 61(TRD1/SQID1/ERXD0/PMD1/RE1) 62(TRD2/SQID2/ERXDV/ECRSDV/AECRSDV/PMD2/RE2) 64(AN18/ERXERR/PMD4/RE4); U28 2(AN16/ETXD0/PMD6/RE6) 3(AN15/ETXD1/PMD7/RE7) 10(AN11/C2INC/RPG9/PMA2/RG9) 11(AN45/C1INA/RPB5/RB5) 12(AN4/C1INB/RB4) 17(PGEC2/AN46/RPB6/RB6) 18(PGED2/AN47/RPB7/RB7) 23(TMS/CVREFOUT/AN5/RPB10/PMA13/RB10) 24(TDO/AN6/PMA12/RB11) 30(AN10/EMDC/AEMDC/RPB15/OCFB/PMA0/RB15) 31(OSC1/CLKI/RC12) 32(OSC2/CLKO/RC15) 33(VBUS) 36(D-) 37(D+) 38(RPF3/USBID/RF3) 45(AERXCLK/AEREFCLK/ECRS/RPD11/PMCS1/PMA14/RD11) 46(AERXD1/ETXD3/RPD0/RTCC/INT0/RD0) 47(SOSCI/RPC13/RC13) 48(SOSCO/RPC14/T1CK/RC14) 52(~{SQICS0}/RPD4/PMWR/RD4) 58(TRD0/SQID0/ERXD1/PMD0/RE0) 61(TRD1/SQID1/ERXD0/PMD1/RE1) 62(TRD2/SQID2/ERXDV/ECRSDV/AECRSDV/PMD2/RE2) 64(AN18/ERXERR/PMD4/RE4)

## Layout directives
differential pair: S1_AIN_N, S1_AIN_P, S1_BUFFO_N, S1_BUFFO_P, S1_DRIVERIN_N, S1_DRIVERIN_P, S1_DRIVERO_N, S1_DRIVERO_P, S1_N, S1_P, S2_AIN_N, S2_AIN_P, S2_BUFFO_N, S2_BUFFO_P, S2_DRIVERIN_N, S2_DRIVERIN_P, S2_DRIVERO_N, S2_DRIVERO_P, S2_N, S2_P, S3_AIN_N, S3_AIN_P, S3_BUFFO_N, S3_BUFFO_P, S3_DRIVERIN_N, S3_DRIVERIN_P, S3_DRIVERO_N, S3_DRIVERO_P, S3_N, S3_P, S4_AIN_N, S4_AIN_P, S4_BUFFO_N, S4_BUFFO_P, S4_DRIVERIN_N, S4_DRIVERIN_P, S4_DRIVERO_N, S4_DRIVERO_P, S4_N, S4_P, Vshunt_S1_N, Vshunt_S1_P, Vshunt_S2_N, Vshunt_S2_P, Vshunt_S3_N, Vshunt_S3_P, Vshunt_S4_N, Vshunt_S4_P

## Notes on the sheet
- @PIN 8
- @PIN 26
- @PIN 39
- @PIN 54
- @PIN 60
- (near C13) @PIN 19
- (near C46) @PIN 19
- THIS DOCUMENT AND THE DATA DISCLOSED HEREIN OR
- HEREWITH IS THE PROPERTY OF ALTIUM LIMITED AND MAY
- DWG NO:
- REVISION
- REV:
- DESCRIPTION
- DATE
- APPROVED
- BE FREELY DISTRIBUTED IN WHOLE. NO RIGHTS ARE
- RESERVED OR EXPRESS OR IMPLIED WARANTEE GIVEN.
- ENG:
- APPROVALS
- PROJECT
- DSN:
- CHK:
- REFERENCE DOCUMENTS
- PROJECT REVISION:
- TITLE
- DOCUMENT REVISION:
- DESIGN ITEM:
- BOM:
- FAB DWG:
- PCB DWG:
- ASSY DWG:
- SCALE:
- A3
- SIZE
- CAGE CODE
- FILE NAME
- DWG NO.
- SHEET
- OF
- REV
- (in symbol 33 uF) +

## Library data of the parts
C1 = 33 uF: TX3B336K016C1000 Aluminum; Supplier 1: Mouser; Supplier Part Number 1: 74-TX3B336K016C1000
C2-C4 C20 C29 C51 C60 = CMP-2007-04598-2: Automotive Ceramic Capacitor, 0805, 1uF, 10%, X7R, 15%, 25V KAF21KR71E105KU; Termination: SMD/SMT; Package Quantity: 2000; Capacitance: 1uF; Depth: 1.25mm; Thickness: 0.055inch; Length: 2.01mm; Min Operating Temperature: -55°C; Dielectric: X7R; Height: 1.4mm; REACH SVHC: No SVHC; Series: FLEXITERM®; Case Code (Imperial): 0805; Tolerance: 10%; Lead Free: Lead Free; Mount: Surface Mount; Packaging: Tape and Reel; Case Code (Metric): 2012; Ratings: AEC-Q200; Voltage Rating (DC): 25V; Voltage Rating: 25V; Max Operating Temperature: 125°C; Case/Package: 0805; Number of Pins: 2; Features: Soft Termination; RoHS Compliant: Yes; Radiation Hardening: No; Width: 0.049inch; Construction: Flat; ComponentLink1Description: New link; ComponentLink1URL: https://www.mouser.com/ProductDetail/KYOCERA-AVX/KAF21KR71E105KU?qs=sGAEpiMZZMuMW9TJLBQkXqLYvz3DzaXfb92J4aJdY3Y%3D>
C5 = 4.7 uF: KAM32LL81H475KU - ceramic; Supplier 1: Mouser; Supplier Part Number 1: 581-KAM32LL81H475KU
C6 = KAF31GR71C106KU: Capacitor KAF31GR71C106KU; Manufacturer_Name: Kyocera AVX; Datasheet Link: https://www.mouser.com/datasheet/2/40/AutoMLCCKAF-3218225.pdf; Height: 0.94mm; Manufacturer_Part_Number: KAF31GR71C106KU; Mouser Part Number: 581-KAF31GR71C106KU; Mouser Price/Stock: https://www.mouser.co.uk/ProductDetail/KYOCERA-AVX/KAF31GR71C106KU?qs=Jm2GQyTW%2Fbhim4Xv0xbSNg%3D%3D
C7 C17 C27 C33 C37 C42 C58 C64 C68 = 293D106X9010C2TE3: Capacitor Polarised 293D106X9010C2TE3; Manufacturer_Name: Vishay; Datasheet Link: http://www.vishay.com/docs/40002/293d.pdf; Height: 2.8mm; Manufacturer_Part_Number: 293D106X9010C2TE3; Mouser Part Number: 74-293D106X9010C2TE3; Mouser Price/Stock: https://www.mouser.co.uk/ProductDetail/Vishay-Sprague/293D106X9010C2TE3?qs=Fp01vWGAG3pfp%2FN4ElsWcw%3D%3D; Arrow Part Number: 293D106X9010C2TE3; Arrow Price/Stock: https://www.arrow.com/en/products/293d106x9010c2te3/vishay
C8 = VZL101M1VTR-0607: Capacitor Polarised VZL101M1VTR-0607; Manufacturer_Name: Lelon; Datasheet Link: http://www.mouser.com/ds/2/231/151002386372-1222327.pdf; Height: 10.5mm; Manufacturer_Part_Number: VZL101M1VTR-0607; Mouser Part Number: 140-VZL101M1VTR-0607; Mouser Price/Stock: https://www.mouser.co.uk/ProductDetail/Lelon/VZL101M1VTR-0607?qs=AQlKX63v8RtivTm9cgLqgQ%3D%3D
C9 = CMP-2007-04594-1: 08052C102K4Z2A; Manufacturer: AVX Interconnect / Elco; Part Number: 08052C102K4Z2A
C10-C15 C28 C30 C34 C36 C38 C40 C43-C47 C49 C59 C61 C65 C67 C69 C71 = CMP-2006-02356-1: Manufacturer: Murata; Part Number: GCM188R71C104KA37J
C16 = EDH227M035A9MAA: Capacitor Polarised EDH227M035A9MAA; Manufacturer_Name: KEMET; Datasheet Link: https://content.kemet.com/datasheets/KEM_A4049_EDH.pdf; Height: 10.5mm; Manufacturer_Part_Number: EDH227M035A9MAA
C18 C19 C23 C26 C35 C48 C50 C54 C57 C66 = CMP-2006-02356-1: GCM188R71C104KA37J; Manufacturer: Murata; Part Number: GCM188R71C104KA37J
C21 C22 C24 C25 C31 C32 C39 C41 C52 C53 C55 C56 C62 C63 C70 C72 = 2 nF: 08053A202JAT2A; Supplier 1: Mouser; Supplier Part Number 1: 581-08053A202JAT2A
D1 = CMP-1055-00016-1: Rectifier, 2-Pin Axial_Lead, Pb-Free, Tape and Reel; Manufacturer: On Semiconductor; IFSM Max (A): 80; Configuration: Single; ComponentLink1URL: http://www.onsemi.com/; ComponentLink2URL: http://www.onsemi.cn/pub_link/Collateral/MBR350-D.PDF; Packing: Tape and Reel; PackageVersion: Rev. G, 06/2000; PackageDescription: 2-Pin, Axial Lead, Diameter 5.05 mm; ComponentLink3URL: http://www.onsemi.com/pub_link/Collateral/267-05.PDF; PartNumber: MBR360RLG; ComponentLink1Description: Manufacturer URL; Mounting Technology: Through Hole; RoHS: TRUE; PackageReference: AXIAL_LEAD-2-267-05; DatasheetVersion: Rev. 6; ComponentLink2Description: Datasheet; ComponentLink3Description: Package Specification
J1 J3-J7 J9-J13 = CMP-2000-05815-1: PCB Terminal Block, 13.5 A, 400 V, 2-Pin THD, RoHS, Bulk; PartNumber: 1729128; Manufacturer: Phoenix Contact; Package Version: 03/2015; No. of Rows: 1; Pitch: 5.08mm; No. of Positions: 2; Voltage Rating: 400V; Current Rating: 13500mA; Manufacturer URL: http://www.phoenixcontact.com/; Datasheet URL: https://datasheet.ciiva.com/16046/1729128-16046181.pdf; RoHS: TRUE; Package URL: https://www.phoenixcontact.com/online/portal/pi/pxc/product_detail_page/!ut/p/b1/3VdJjqNKFDxLH8AFycySyWY2ozFsEPOMMQaDOX1XedGL_1Vdm5YXJleknhSKeBkvI6EA8ncAo3AYoDhBQGco6KN7VURTdemj9us_IEKEZo_YHiPAEWEFmDGOHMORkqKYCORBZxgL7ZoaZYcbFFUZ3fqxSY6GOuxydWUuHqz1ynmMFygu583Bob0Ewr6Sd_l-5m-kAueHiB0jpRwZwe58wwtkpxtMYd_LmGcDRU02dRNEyWt6Y2ti5pSyJ_reIkzIulrqApdnbT11V5jnCKbYNCvhEM1MCpPByat_X379-iThf08CI5GfOPqfBeS3BRoBOdD55AKVv0iLwCMq-2BrzXWSGRH7pUGD9uwXQjiph3xL0DKQwdGa0JImiIOmBNOestqgwTHSSs2oOep-78apyXQBvNi8ZLaFjvjWvcaUEBu0MC6Wbe-d6mB0FAebo2lUWinqYaZs5DAYzV0RP9yitUjnGJ0iI9xhZkT42OCQNUJJhkgWINNQLP2JFP6OpMg3JCVg70jqHT0lvKOnhHf0lPuOnnLf0VPuWx6_dxwUIvwk5WMkT0kLL1mh61l2yZVSzG3pYV_bqo-mj6uMKwKwdnnW8Jh5RTOJzMOA5c-eJDaZQw4mTMPH02PvS_ZAqNVjVTo2WyYLkwH_KU1mmmG5kjRhDqPXLwwVHvVOjCM60-fpXvTDfMGW1PVFVS1r4e4yVDk4ZdNbkUHvqPqQSeian4UD39fNKmachqdJ1NJbyk8rXT9mXTvPk3oE5meulKGgiruPJek-4I9hTT6G8ZLOyRSm2RRVbThERQad5OS28hdt4YW4vG0stgYYzsWsK4_7y6DZMjJSCqri1kyiZR5vD7pwIrNR7QwPHTcLTI5qT7eRlpHrdGiupYlqQDJ7zy_CND8fWWBoLRXxk1RVcXiBQwbTD4Xi7KL-FuO94t9xaqweXzH; Package Description: 2-Pin Through Hole Device, Body 8.1 x 10.16 mm, Pitch 5.08 mm; Datasheet Version: 12/2013; Mounting Technology: ThroughHole; Orientation: Horizontal; Package Reference: 1729128-2; Packing: Bulk
L1 = CMP-14484-000176-1: SMD Inductors 330uH ±10% 0.09A 15.99Ω 1007 CBC2518T331K; Test Frequency: 796kHz; Shielding: Unshielded; Self Resonant Frequency: 4.5MHz; Current Rating: 90mA; Saturation Current: 100mA; Core Material: Ferrite; DC Resistance (DCR): 15.99R; Halogen Free: Halogen Free; Width: 0.071inch; RoHS Compliant: Yes; Inductance: 330uH; Height: 1.8mm; Case Code (Metric): 2518; Tolerance: 10%; Inductance Tolerance: 10%; Lead Free: Lead Free; Termination: SMD/SMT; Radiation Hardening: No; Depth: 2mm; Height - Seated (Max): 0.079inch; Case Code (Imperial): 1007; Case/Package: 1007; Series: CB; Packaging: Tape and Reel; Package Quantity: 2000; Max DC Current: 90mA; Resistor Type: Wirewound; Min Operating Temperature: -40°C; Max Operating Temperature: 105°C; Mount: Surface Mount; Length: 0.098inch
R1 R2 R6 R12 R14 R22 R30 R32 R33 R38 R42 R48 R50 R58 R66 R68 R69 R74 = Resistor_4.7K_PU: ERA-3AED472V; Supplier 1: Mouser; Supplier Part Number 1: 667-ERA-3AED472V
R3 = Resistor_100K_reg: RQ73C1J100KBTD; Supplier 1: Avnet; Supplier Part Number 1: 97AC0504
R4 = Resistor_4.3K_reg: ERA-3ARW432V; Supplier 1: Mouser; Supplier Part Number 1: 667-ERA-3ARW432V
R5 = Resistor_5.6K_reg: ERA-3ARB562V; Supplier 1: Mouser; Supplier Part Number 1: 667-ERA-3ARB562V
R7 R8 R10 R13 R15 R17 R20 R21 R23 R26-R28 R31 R35 R37 R39 R41 R43 R44 R46 R49 R51 R53 R56 R57 R59 R62-R64 R67 R71 R73 R75 R77 = Resistor_1K_signal: Thin Film Resistors - SMD RQ 0603 1K0 0.1% 10PPM 5K RL RQ73C1J1K0BTD; Supplier 1: Future Electronics; Supplier Part Number 1: 5134876
R9 R11 R18 R19 R24 R25 R29 R36 R40 R45 R47 R54 R55 R60 R61 R65 R72 R76 = Resistor_10K_sig: ERA-2VRB1002X; Supplier 1: Mouser; Supplier Part Number 1: 667-ERA-2VRB1002X
R16 R34 R52 R70 = CMP-2000-03062-2: RES Thick Film, 200Ω, 1%, 0.1W, 100ppm/°C, 0603 CRCW0603200RFKEA; Power Rating: 100mW; Voltage Rating (DC): 75V; Resistance: 200R; Military Standard: Not; Tolerance: 1%; Lead Free: Lead Free; Case Code (Imperial): 0603; Depth: 0.85mm; Max Operating Temperature: 155°C; Contact Plating: Tin; Length: 1.55mm; Weight: 7.1E-05oz; Voltage Rating: 75V; Height: 0.45mm; Min Operating Temperature: -55°C; Case/Package: 0603; Number of Pins: 2; Composition: Thick Film; Termination: SMD/SMT; Case Code (Metric): 1608; Width: 0.85mm; Package Quantity: 5000; Temperature Coefficient: 100ppm/°C; Packaging: Tape and Reel
U1 = CMP-0136-00244-1: 500 mA, Low Voltage, Low Quiescent Current LDO Regulator, 8-Pin SOIC 150mil, Extended Temperature; Code_JEDEC: MS-012; PackageVersion: revBB, Aug-2009; Code_IPC: SOIC127P600-8; PackageDescription: 8-Lead Plastic Small Outline (SN) - Narrow, 3.90mm Body [SOIC]; PackageReference: SOIC-SN8; DatasheetVersion: revB, Dec-2007
U2 = CMP-0367-00041-2: Low Noise, Very Low Drift, Precision Voltage Reference, -40 to 125 degC, 8-pin SOIC (D), Green (RoHS & no Sb/Br); Manufacturer: Texas Instruments; VO(V): 2.5; Iout/Iz(Max)(mA): 10; Initial Accuracy @ 25/deg C(%): 0.05; VI(Max)(V): 18; Iq(Max)(uA): 1000; Rating: Military; Temp Coeff(Max)(ppm/ degree C): 3; SubFamily: Series Voltage Reference; VI(Min)(V): 2.7; DatasheetVersion: SBOS410E; Eco-Plan: Green (RoHS & no Sb/Br); ComponentLink2URL: http://www.ti.com/general/docs/lit/getliterature.tsp?genericPartNumber=REF5025&fileType=pdf; PackageVersion: 4040047-3/M; PackageDescription: 8-Pin Plastic Small Outline, Body 4.9 x 3.9 mm, Pitch 1.27 mm; PartNumber: REF5025AIDR; ComponentLink3Description: Package Specification; ComponentLink1URL: http://www.ti.com/; ComponentLink1Description: Manufacturer URL; PackageReference: D0008A; ComponentLink3URL: http://www.ti.com/litv/pdf/msoi002j; Mounting Technology: Surface Mount; ComponentLink2Description: Datasheet; Code_JEDEC: MS-012
U3 = CMP-00252-66660348-1: LM2575-5.0WU BUCK, 40VIN, 52KHZ, 1A, 5V, 5TO263; Primary Input Voltage: 40V; No. of Outputs: 1;; Output Configuration: Positive; Min Input Voltage: 4V; Nominal Supply Current: 5mA; Max Duty Cycle: 98%; Output Type: Fixed; Efficiency: 82%; Synchronous Rectifier: No; Number of Channels: 1; Max Junction Temperature (Tj): 125°C; Lead Free: Lead Free; Switching Frequency: 52kHz; Mount: Surface Mount; Max Input Voltage: 40V; Max Supply Voltage: 40V; Case/Package: TO-263-6; RoHS: Compliant; Packaging: Cut Tape; Max Operating Temperature: 85°C; REACH SVHC: No SVHC; NexarPartId: 66660348; Output Current: 1A; Number of Pins: 5; Nominal Output Voltage: 5V; Min Supply Voltage: 4V; Min Output Voltage: 5V; Lifecycle Status: Production; Number of Outputs: 1; Max Output Current: 1A; Width: 9.17mm; Height: 4.59mm; Length: 10.67mm; Min Operating Temperature: -40°C; Output Voltage: 5V
U4 = CMP-00370-110297362-1: TPS7B8633QDDARQ1 Automotive 500-mA, 40-V, ultra-low-IQ, low-dropout (LDO) linear regulator with power good; Manufacturer Lifecycle Status: ACTIVE; NexarPartId: 110297362; Height: 1.7mm; Length: 4.89mm; Width: 3.9mm; Thickness: 1.48mm; Number of Pins: 8; Lifecycle Status: Production
U5 = CMP-0272-01099-3: 1 uA, Rail-to-Rail, CMOS Operational Amplifier, 1.8 to 5.5 V, 0 to 85 degC, 5-pin SOT23 (DCK5), Green (RoHS & no Sb/Br); Manufacturer: Texas Instruments; Vio (25C)(Max)(mV): 10; Packing: LARGE T&R; Iq per channel(Max)(mA): 0.002; Rating: Catalog; CMRR(Min)(dB): 48; Total Supply Voltage(Min)(+5V is 5, +/-5V is 10): 1.8; Slew Rate(Typ)(V/us): 0.02; Offset Drift(Typ)(uV/C): 15; Number of Channels: 1; Sub Family: Low Input Bias Current Amp (<=10pA), Low Power Amp (<=500uA), Low Supply Voltage Amplifier (<=2.7V), Precision Amplifier; GBW(Typ)(MHz): 0.07; Total Supply Voltage(Max)(+5V is 5, +/-5V is 10): 5.5; ComponentLink3Description: Package Specification; PartNumber: OPA349SA/3K; ComponentLink2Description: Datasheet; Code_JEDEC: MO-203; ComponentLink1Description: Manufacturer URL; PackageDescription: 5-Pin Plastic Small Outline, Body 2 x 1.25 mm, Pitch 0.65 mm; Eco-Plan: Green (RoHS & no Sb/Br); PackageVersion: 4093553-3/G, 01/2007; ComponentLink2URL: http://www.ti.com/lit/ds/symlink/opa349.pdf; Mounting Technology: Surface Mount; ComponentLink1URL: http://www.ti.com/; PackageReference: DCK0005A; ComponentLink3URL: http://www.ti.com/litv/pdf/mpds025f; IIB(Max)(pA): 10; DatasheetVersion: SBOS121B
U6 U9 U12 U14 U17 U20 U24 U27 U30 U32 U35 U38 = CMP-0272-01093-3: Low-Cost, Low Noise, 5.5 MHz CMOS Operational Amplifier, 2.2 to 5.5 V, -40 to 125 degC, 5-pin SOT23 (DCK5), Green (RoHS & no Sb/Br); Manufacturer: Texas Instruments; Iq per channel(Max)(mA): 1.05; Vn at 1kHz(Typ)(nV/rtHz): 7.5; Total Supply Voltage(Max)(+5V is 5, +/-5V is 10): 5.5; Slew Rate(Typ)(V/us): 2; CMRR(Min)(dB): 70; Number of Channels: 1; Total Supply Voltage(Min)(+5V is 5, +/-5V is 10): 2.2; Sub Family: Low Input Bias Current Amp (<=10pA), Low Noise Amp (<=10nV/rtHz), Low Supply Voltage Amplifier (<=2.7V), Precision Amplifier; IIB(Max)(pA): 10; Offset Drift(Typ)(uV/C): 0.32; ComponentLink2Description: Datasheet; Mounting Technology: Surface Mount; ComponentLink2URL: http://www.ti.com/general/docs/lit/getliterature.tsp?genericPartNumber=OPA377&fileType=pdf; ComponentLink1Description: Manufacturer URL; ComponentLink1URL: http://www.ti.com/; PartNumber: OPA377AIDCKR; PackageReference: DCK0005A; PackageVersion: 4093553-3/G, 01/2007; Eco-Plan: Green (RoHS & no Sb/Br); DatasheetVersion: SBOS504B; Vio (25C)(Max)(mV): 1; Code_JEDEC: MO-203; ComponentLink3URL: http://www.ti.com/litv/pdf/mpds025f; PackageDescription: 5-Pin Plastic Small Outline, Body 2 x 1.25 mm, Pitch 0.65 mm; ComponentLink3Description: Package Specification
U7 U16 U25 U34 = MCP33131D-10T-I/MS: Analog to Digital Converters - ADC 16-bit, 1 Msps, single channel, differential SAR ADC; ComponentLink1Description: New link; ComponentLink1URL: https://www.mouser.com/datasheet/2/268/MCP33131D_Data_Sheet_DS20005947B-3443995.pdf
U8 U13 U15 U21 U26 U31 U33 U39 = MCP6D11T-E/MS: Differential Amplifiers Single, Fully Differential Amplifier, E Temp; ComponentLink1Description: New link; ComponentLink1URL: https://www.mouser.com/datasheet/2/268/MCP6D11_Data_Sheet_DS20006162A-3443772.pdf
U10 U28 = CMP-06276-000703-1: IC MCU 32BIT 2MB FLASH 64TQFP; Peripherals: Brown-out Detect/Reset; Frequency: 200MHz; Oscillator Type: Internal; Interface: I2C; Number of I/Os: 46; RoHS Compliant: Yes; Packaging: Tray; Series: PIC® 32MZ; Memory Type: FLASH; Case/Package: TQFP; Max Operating Temperature: 85°C; Min Operating Temperature: -40°C; Mount: Surface Mount; Memory Size: 2MB
U18 U22 U36 U40 = CMP-0004-00142-1: 16-Bit, Ultra-Low Power, Voltage Output Digital to Analog Converter, -40 to 85 degC, 8-pin SOIC (D8), Green (RoHS & no Sb/Br); Manufacturer: Texas Instruments; Power Consumption(Typ)(mW): 0.015; DAC Channels: 1; Interface: Serial SPI; Resolution(Bits): 16; SubFamily: Precision DAC (=<10MSPS); DatasheetVersion: SLAS449D; ComponentLink3Description: Package Specification; Eco-Plan: Green (RoHS & no Sb/Br); ComponentLink2URL: http://www.ti.com/general/docs/lit/getliterature.tsp?genericPartNumber=DAC8830&fileType=pdf; INL(Max)(+/-LSB): 1; Code_JEDEC: MS-012; ComponentLink1URL: http://www.ti.com/; Settling Time(us): 1; ComponentLink3URL: http://www.ti.com/litv/pdf/msoi002j; ComponentLink2Description: Datasheet; Mounting Technology: Surface Mount; DNL(Max)(+/-LSB): 1; PackageDescription: 8-Pin Plastic Small Outline, Body 4.9 x 3.9 mm, Pitch 1.27 mm; PartNumber: DAC8830ICD; PackageVersion: 4040047-3/M, 06/2011; PackageReference: D8; ComponentLink1Description: Manufacturer URL
U19 U23 U37 U41 = CMP-0272-03251-3: CMOS, Rail-to-Rail I/O, Operational Amplifier, 4 to 12 V, -40 to 85 degC, 8-pin SOIC (D8), Green (RoHS & no Sb/Br); Manufacturer: Texas Instruments; Total Supply Voltage(Min)(+5V is 5, +/-5V is 10): 4; GBW(Typ)(MHz): 3; CMRR(Min)(dB): 70; Vio (25C)(Max)(mV): 0.75; Number of Channels: 1; Total Supply Voltage(Max)(+5V is 5, +/-5V is 10): 12; Sub Family: Low Input Bias Current Amp (<=10pA), Low Power Amp (<=500uA), Precision Amplifier; Iq per channel(Max)(mA): 0.2; IIB(Max)(pA): 10; Packing: TUBE; Rating: Catalog; PackageVersion: 4040047-3/M, 06/2011; ComponentLink1URL: http://www.ti.com/; Eco-Plan: Green (RoHS & no Sb/Br); Offset Drift(Typ)(uV/C): 4; PackageDescription: 8-Pin Plastic Small Outline, Body 4.9 x 3.9 mm, Pitch 1.27 mm; ComponentLink3Description: Package Specification; Slew Rate(Typ)(V/us): 3; ComponentLink3URL: http://www.ti.com/litv/pdf/msoi002j; ComponentLink2URL: http://www.ti.com/lit/ds/symlink/opa704.pdf; PartNumber: OPA704UA; Mounting Technology: Surface Mount; ComponentLink2Description: Datasheet; ComponentLink1Description: Manufacturer URL; PackageReference: D0008A; DatasheetVersion: SBOS180A; Code_JEDEC: MS-012